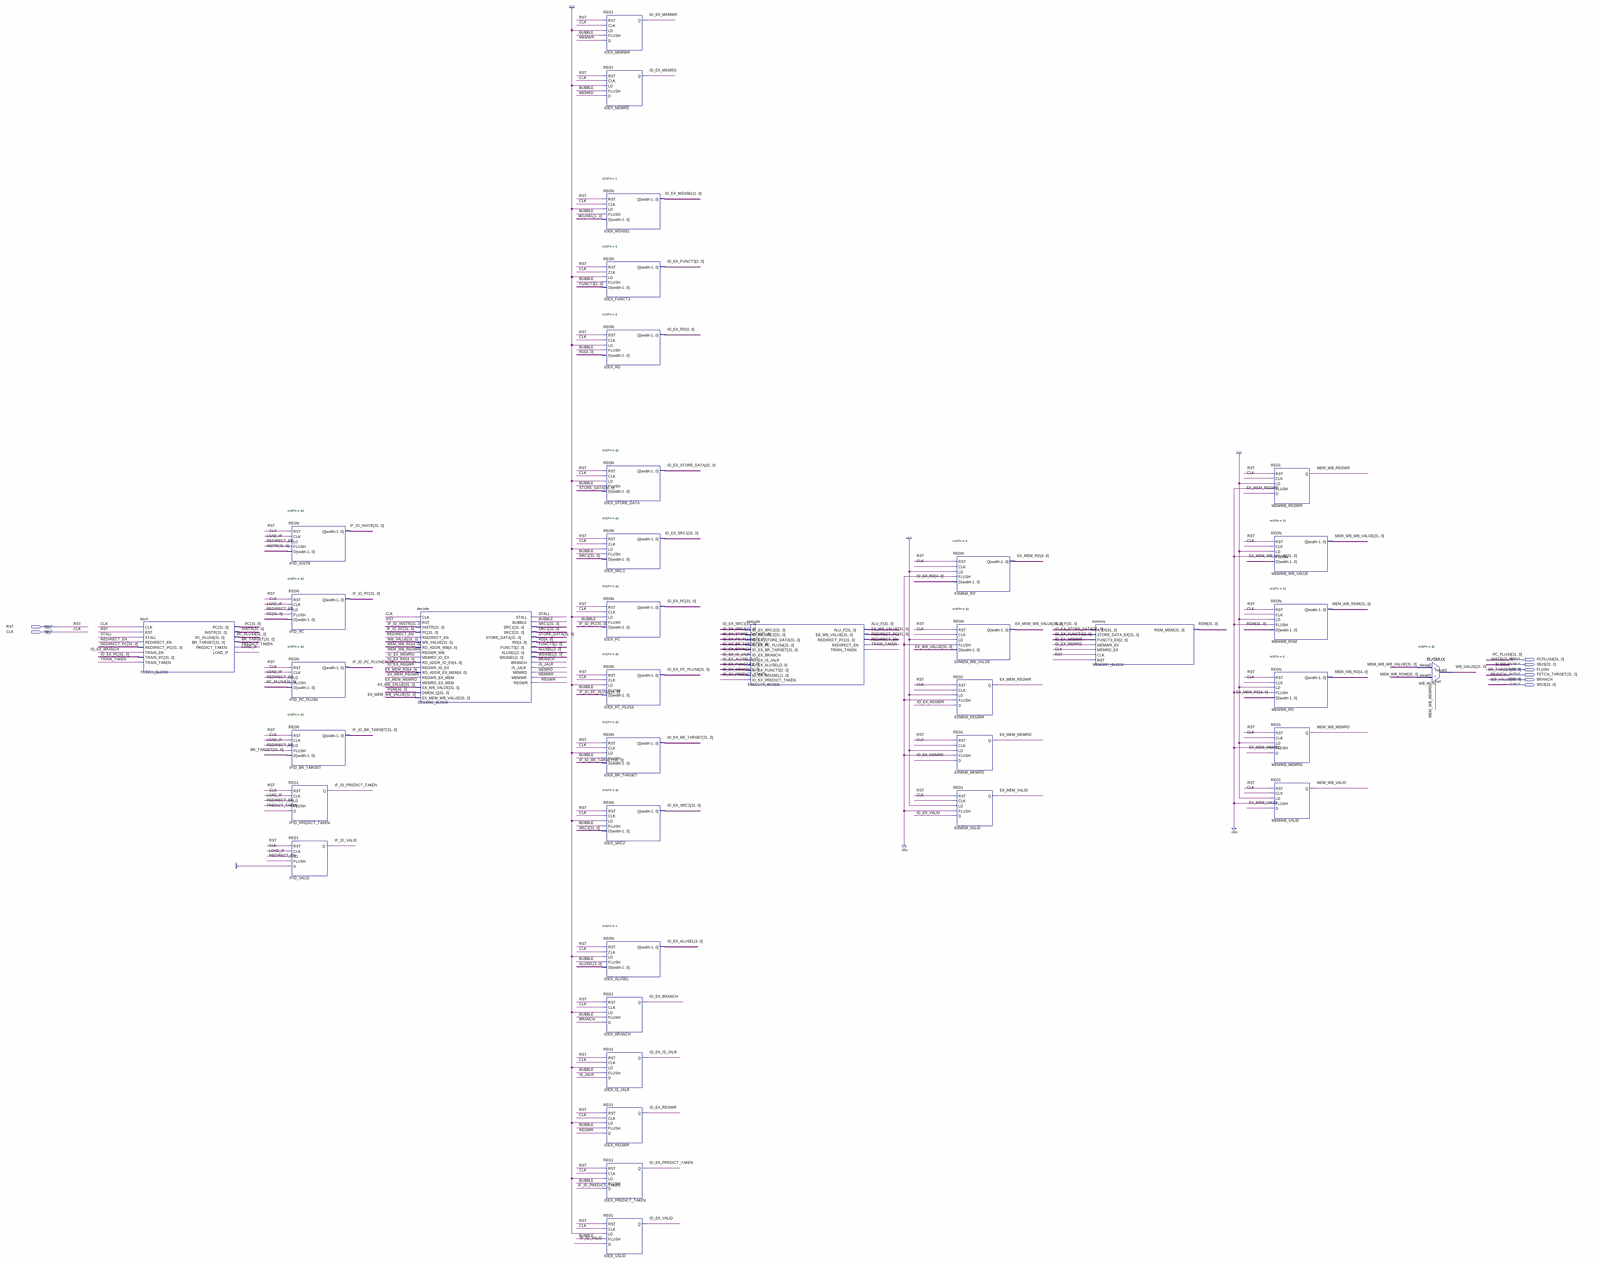
[diagram p0: schematic sheet, whole]
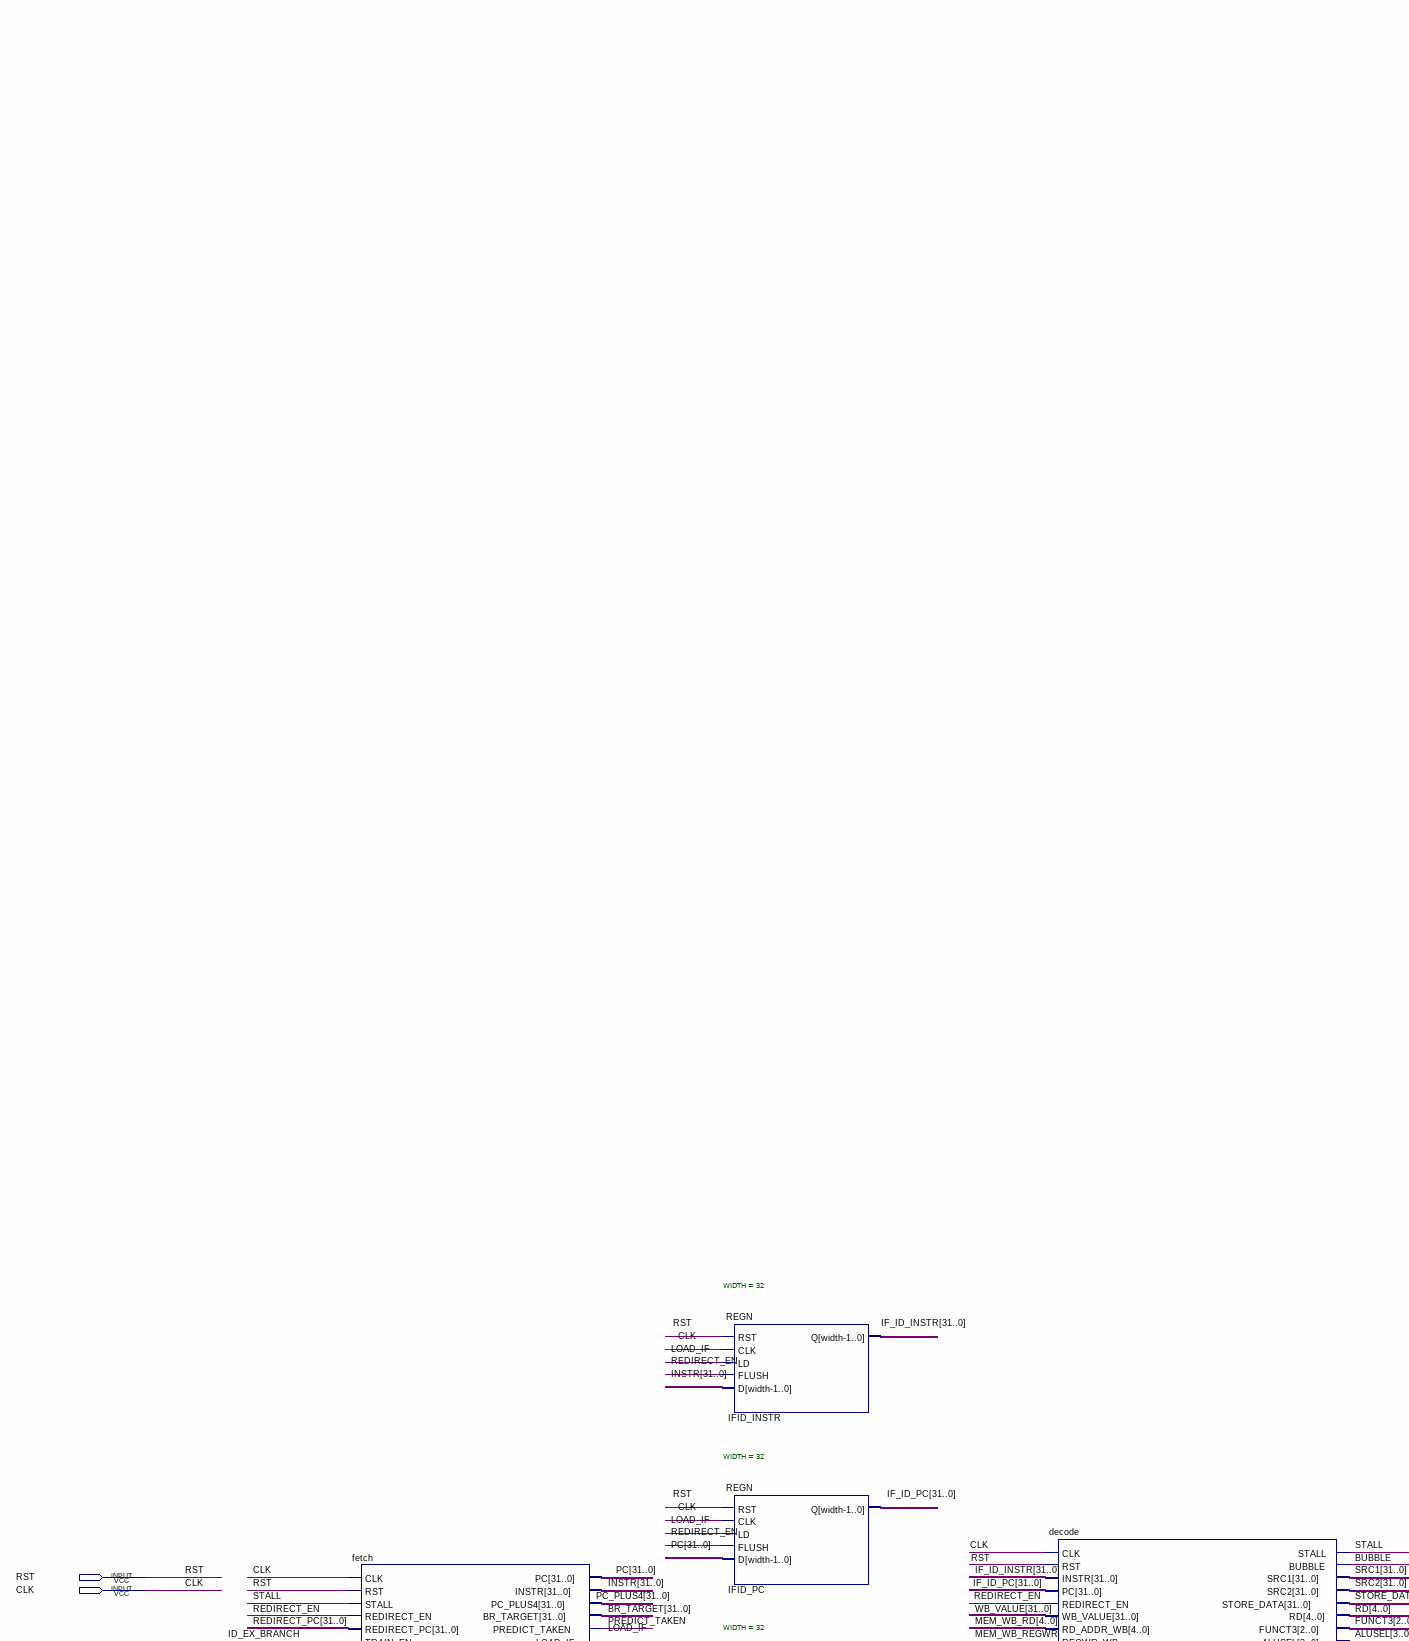
[diagram p1: schematic sheet, upper left part]
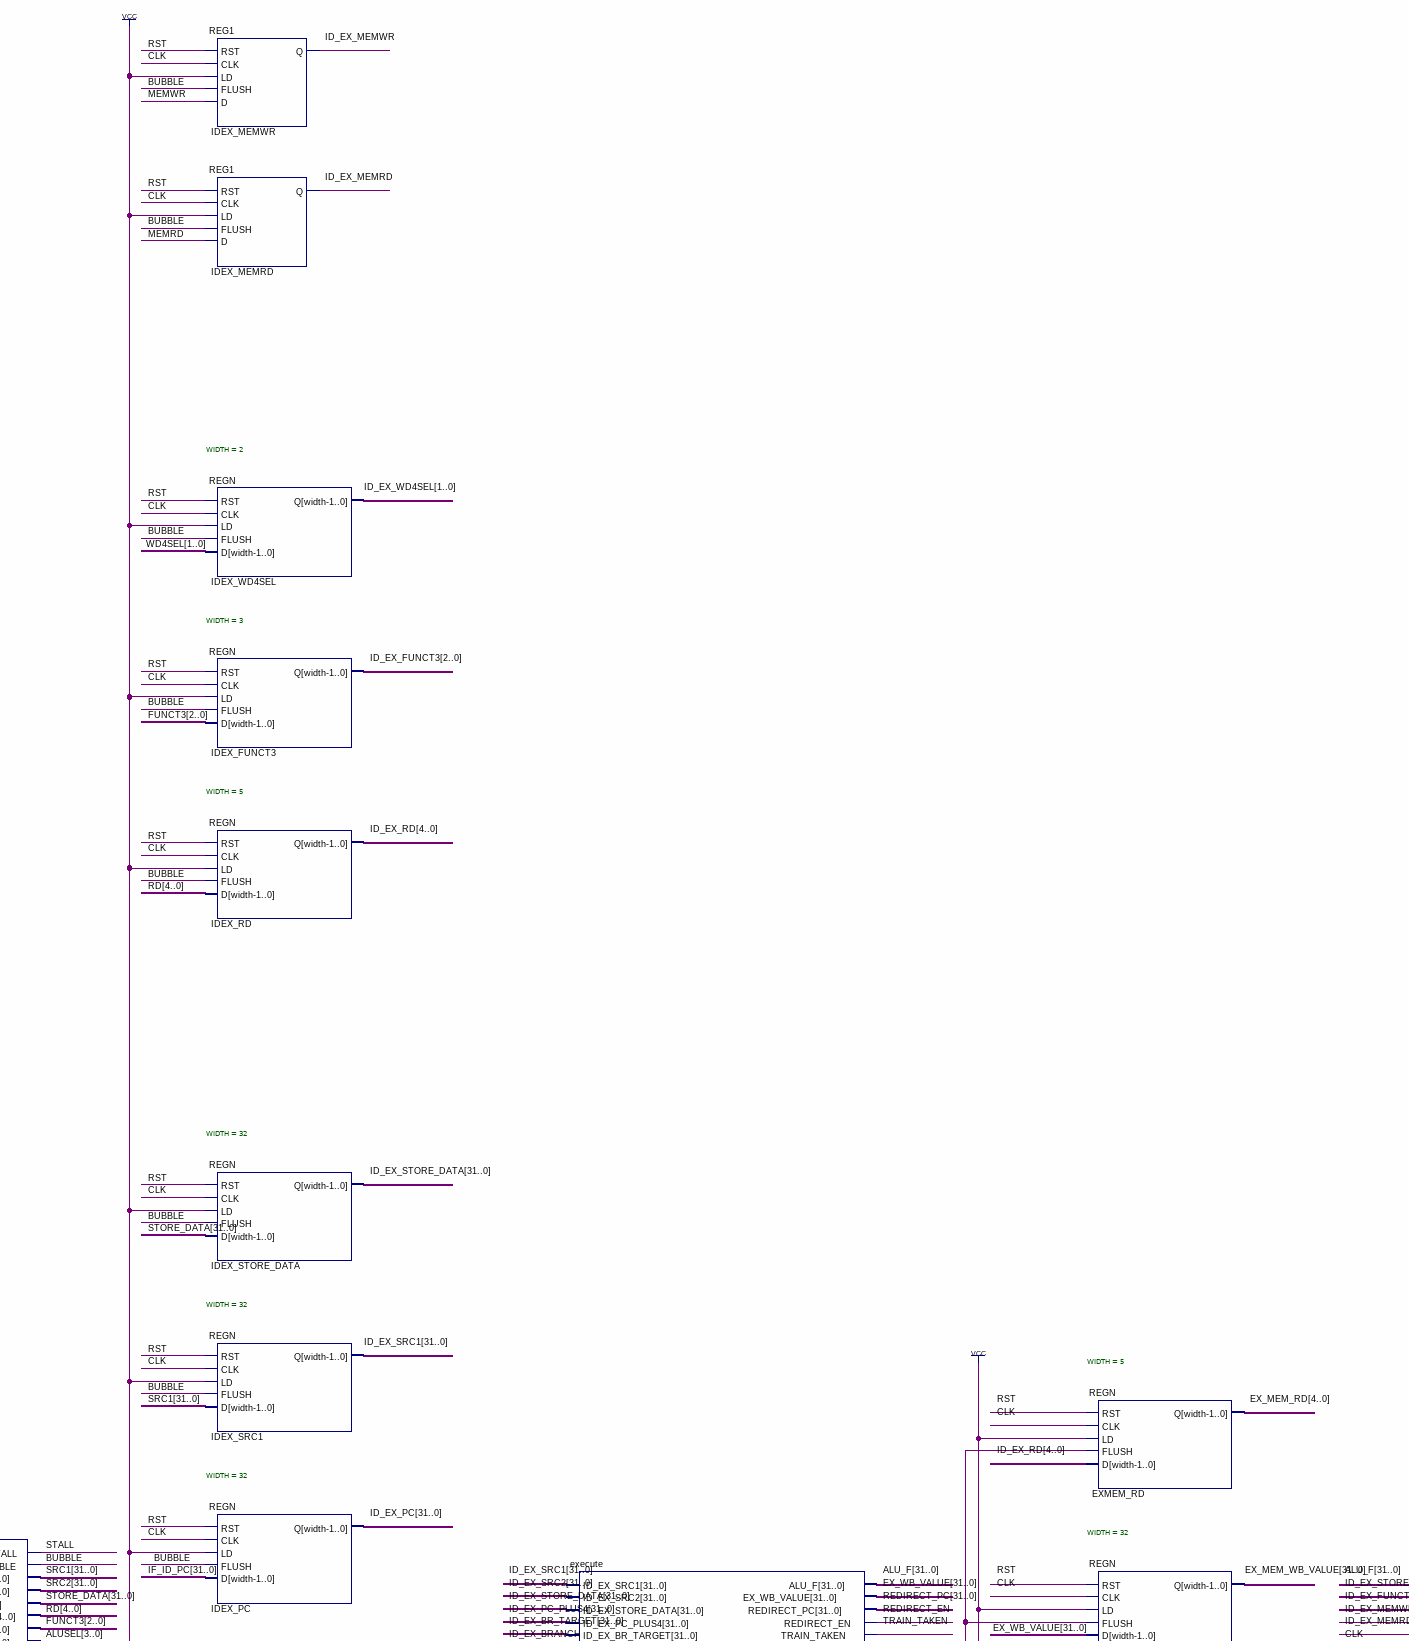
[diagram p2: schematic sheet, upper centre part]
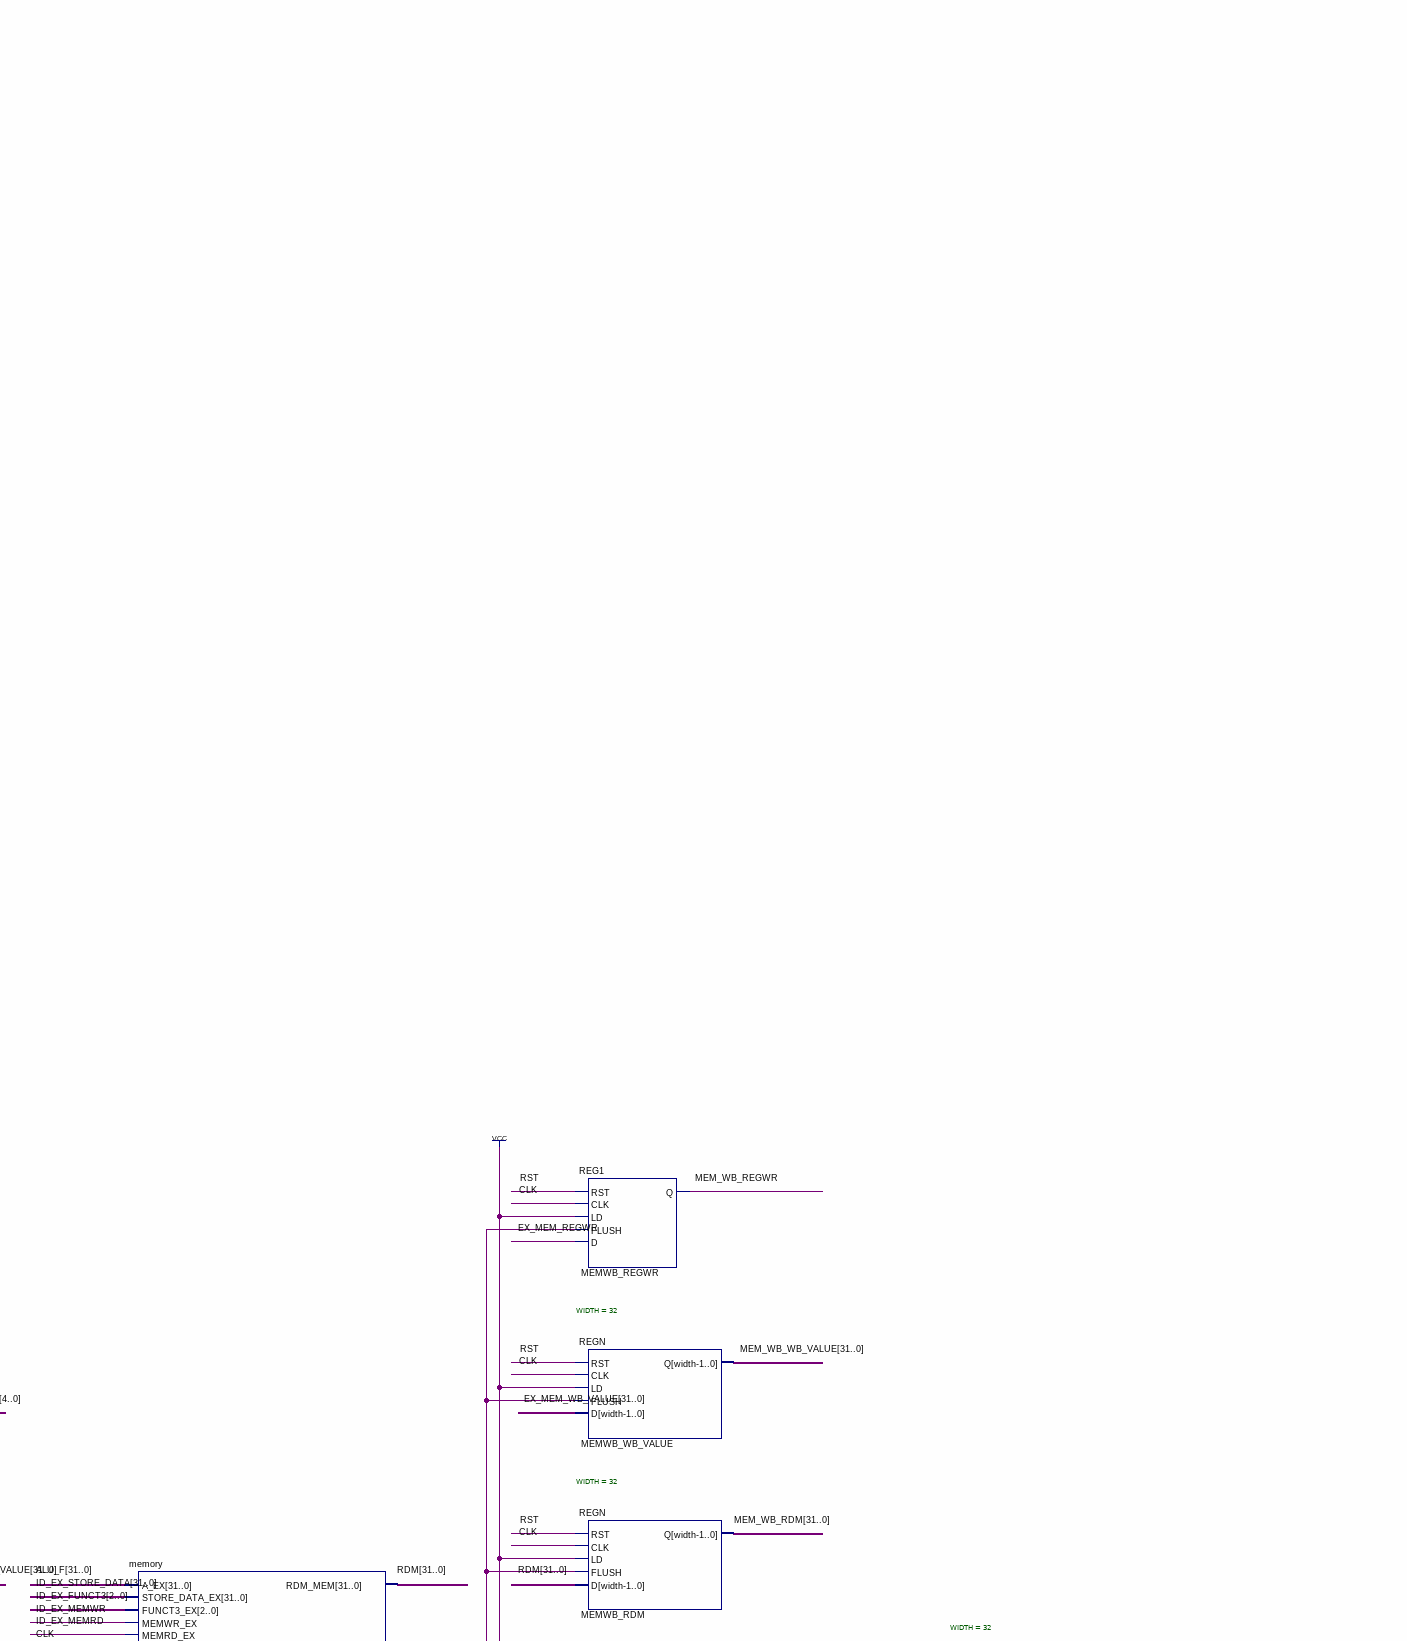
[diagram p3: schematic sheet, upper right part]
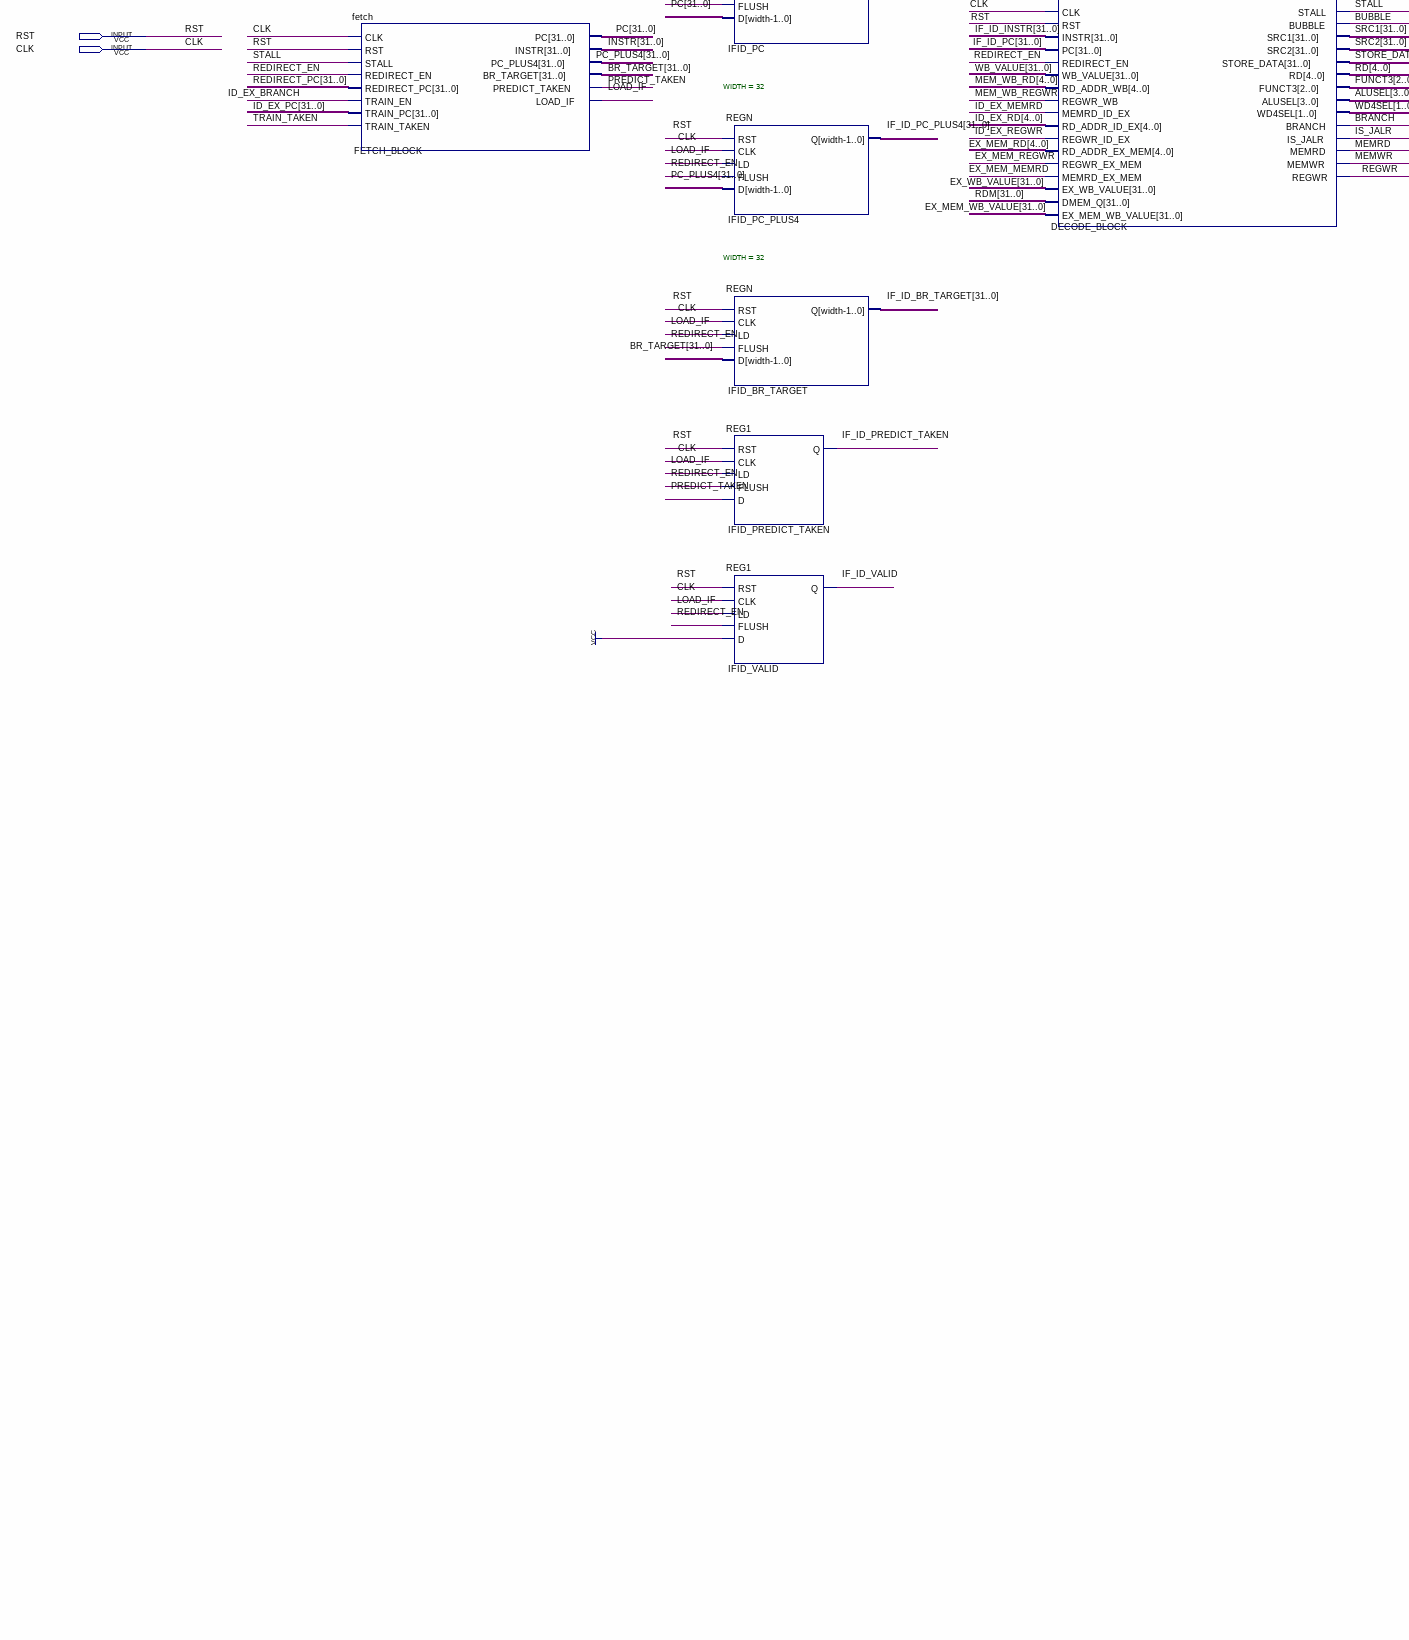
[diagram p4: schematic sheet, lower left part]
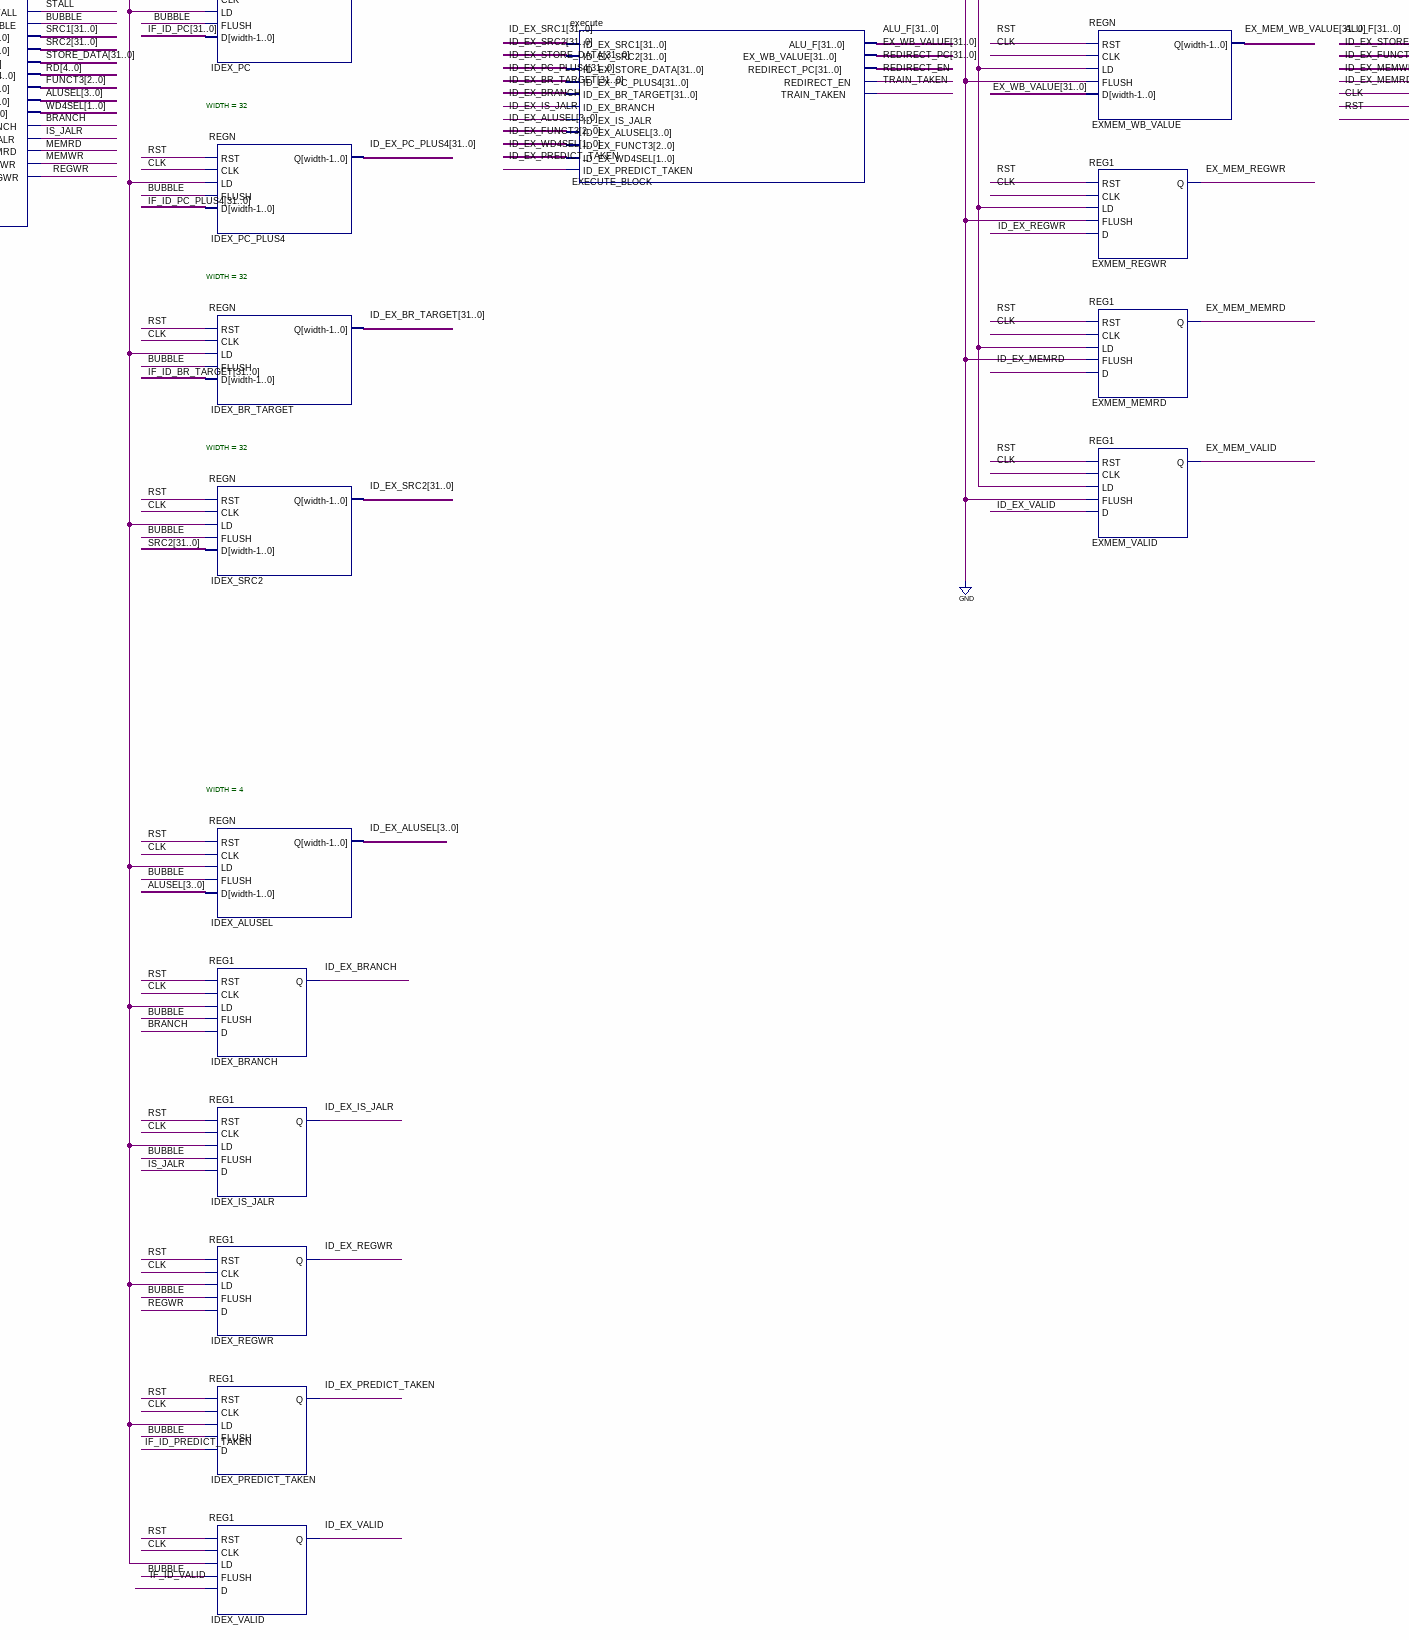
[diagram p5: schematic sheet, lower centre part]
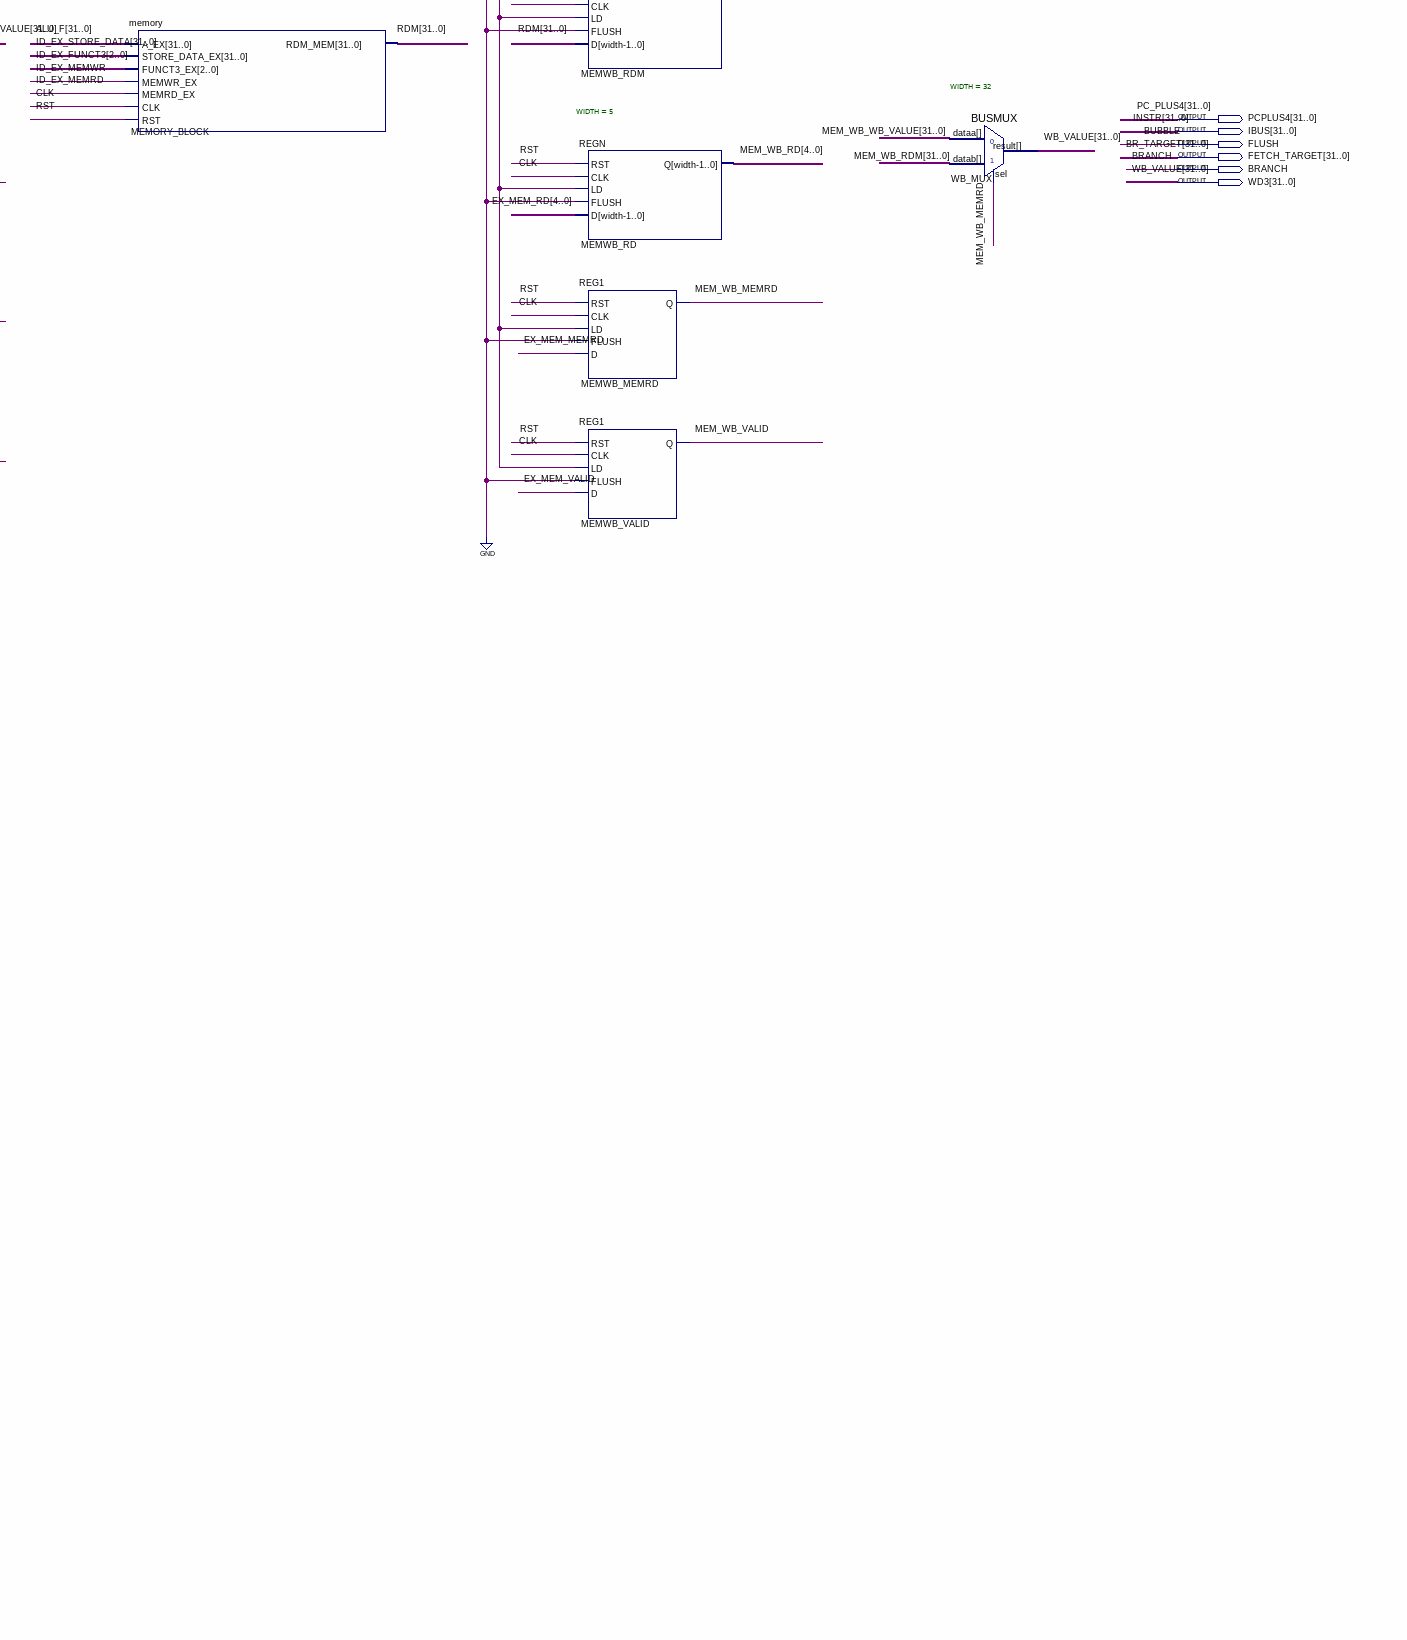
[diagram p6: schematic sheet, lower right part]
// Quartus schematic pipeline.bdf as structural Verilog: 39 symbols, 8 pins
module pipeline (
  input  RST,
  input  CLK,
  output [31:0] PCPLUS4,
  output [31:0] IBUS,
  output FLUSH,
  output [31:0] FETCH_TARGET,
  output BRANCH,
  output [31:0] WD3
);

  wire EX_MEM_MEMRD, EX_MEM_REGWR, EX_MEM_VALID, ID_EX_BRANCH, ID_EX_IS_JALR, ID_EX_MEMRD, ID_EX_MEMWR,
       ID_EX_PREDICT_TAKEN, ID_EX_REGWR, ID_EX_VALID, IF_ID_PREDICT_TAKEN, IF_ID_VALID, IS_JALR, LOAD_IF,
       MEM_WB_MEMRD, MEM_WB_REGWR, MEM_WB_VALID, MEMRD, MEMWR, PREDICT_TAKEN, REDIRECT_EN, REGWR, STALL,
       TRAIN_TAKEN;
  wire [1:0] ID_EX_WD4SEL, WD4SEL;
  wire [2:0] FUNCT3, ID_EX_FUNCT3;
  wire [3:0] ALUSEL, ID_EX_ALUSEL;
  wire [4:0] EX_MEM_RD, ID_EX_RD, MEM_WB_RD, RD;
  wire [31:0] ALU_F, EX_MEM_WB_VALUE, EX_WB_VALUE, ID_EX_BR_TARGET, ID_EX_PC, ID_EX_PC_PLUS4, ID_EX_SRC1,
       ID_EX_SRC2, ID_EX_STORE_DATA, IF_ID_BR_TARGET, IF_ID_INSTR, IF_ID_PC, IF_ID_PC_PLUS4, MEM_WB_RDM,
       MEM_WB_WB_VALUE, PC, RDM, REDIRECT_PC, SRC1, SRC2, STORE_DATA;

  fetch FETCH_BLOCK (
    .CLK(CLK), .RST(RST), .STALL(STALL), .REDIRECT_EN(REDIRECT_EN), .REDIRECT_PC(REDIRECT_PC),
    .TRAIN_EN(ID_EX_BRANCH), .TRAIN_PC(ID_EX_PC), .TRAIN_TAKEN(TRAIN_TAKEN), .PC(PC), .INSTR(IBUS),
    .PC_PLUS4(PCPLUS4), .BR_TARGET(FETCH_TARGET), .PREDICT_TAKEN(PREDICT_TAKEN), .LOAD_IF(LOAD_IF));
  REGN #(.WIDTH(32)) IFID_INSTR (.RST(RST), .CLK(CLK), .LD(LOAD_IF), .FLUSH(REDIRECT_EN), .D(IBUS), .Q(IF_ID_INSTR));
  REGN #(.WIDTH(32)) IFID_PC (.RST(RST), .CLK(CLK), .LD(LOAD_IF), .FLUSH(REDIRECT_EN), .D(PC), .Q(IF_ID_PC));
  REGN #(.WIDTH(32)) IFID_PC_PLUS4 (
    .RST(RST), .CLK(CLK), .LD(LOAD_IF), .FLUSH(REDIRECT_EN), .D(PCPLUS4), .Q(IF_ID_PC_PLUS4));
  REGN #(.WIDTH(32)) IFID_BR_TARGET (
    .RST(RST), .CLK(CLK), .LD(LOAD_IF), .FLUSH(REDIRECT_EN), .D(FETCH_TARGET), .Q(IF_ID_BR_TARGET));
  REG1 IFID_PREDICT_TAKEN (
    .RST(RST), .CLK(CLK), .LD(LOAD_IF), .FLUSH(REDIRECT_EN), .D(PREDICT_TAKEN), .Q(IF_ID_PREDICT_TAKEN));
  REG1 IFID_VALID (.RST(RST), .CLK(CLK), .LD(LOAD_IF), .FLUSH(REDIRECT_EN), .D(1'b1), .Q(IF_ID_VALID));
  decode DECODE_BLOCK (
    .CLK(CLK), .RST(RST), .INSTR(IF_ID_INSTR), .PC(IF_ID_PC), .REDIRECT_EN(REDIRECT_EN), .WB_VALUE(WD3),
    .RD_ADDR_WB(MEM_WB_RD), .REGWR_WB(MEM_WB_REGWR), .MEMRD_ID_EX(ID_EX_MEMRD), .RD_ADDR_ID_EX(ID_EX_RD),
    .REGWR_ID_EX(ID_EX_REGWR), .RD_ADDR_EX_MEM(EX_MEM_RD), .REGWR_EX_MEM(EX_MEM_REGWR),
    .MEMRD_EX_MEM(EX_MEM_MEMRD), .EX_WB_VALUE(EX_WB_VALUE), .DMEM_Q(RDM), .EX_MEM_WB_VALUE(EX_MEM_WB_VALUE),
    .STALL(STALL), .BUBBLE(FLUSH), .SRC1(SRC1), .SRC2(SRC2), .STORE_DATA(STORE_DATA), .RD(RD),
    .FUNCT3(FUNCT3), .ALUSEL(ALUSEL), .WD4SEL(WD4SEL), .BRANCH(BRANCH), .IS_JALR(IS_JALR), .MEMRD(MEMRD),
    .MEMWR(MEMWR), .REGWR(REGWR));
  REG1 IDEX_MEMWR (.RST(RST), .CLK(CLK), .LD(1'b1), .FLUSH(FLUSH), .D(MEMWR), .Q(ID_EX_MEMWR));
  REG1 IDEX_MEMRD (.RST(RST), .CLK(CLK), .LD(1'b1), .FLUSH(FLUSH), .D(MEMRD), .Q(ID_EX_MEMRD));
  REGN #(.WIDTH(2)) IDEX_WD4SEL (.RST(RST), .CLK(CLK), .LD(1'b1), .FLUSH(FLUSH), .D(WD4SEL), .Q(ID_EX_WD4SEL));
  REGN #(.WIDTH(3)) IDEX_FUNCT3 (.RST(RST), .CLK(CLK), .LD(1'b1), .FLUSH(FLUSH), .D(FUNCT3), .Q(ID_EX_FUNCT3));
  REGN #(.WIDTH(5)) IDEX_RD (.RST(RST), .CLK(CLK), .LD(1'b1), .FLUSH(FLUSH), .D(RD), .Q(ID_EX_RD));
  REGN #(.WIDTH(32)) IDEX_STORE_DATA (
    .RST(RST), .CLK(CLK), .LD(1'b1), .FLUSH(FLUSH), .D(STORE_DATA), .Q(ID_EX_STORE_DATA));
  REGN #(.WIDTH(32)) IDEX_SRC1 (.RST(RST), .CLK(CLK), .LD(1'b1), .FLUSH(FLUSH), .D(SRC1), .Q(ID_EX_SRC1));
  REGN #(.WIDTH(32)) IDEX_PC (.RST(RST), .CLK(CLK), .LD(1'b1), .FLUSH(FLUSH), .D(IF_ID_PC), .Q(ID_EX_PC));
  REGN #(.WIDTH(32)) IDEX_PC_PLUS4 (
    .RST(RST), .CLK(CLK), .LD(1'b1), .FLUSH(FLUSH), .D(IF_ID_PC_PLUS4), .Q(ID_EX_PC_PLUS4));
  REGN #(.WIDTH(32)) IDEX_BR_TARGET (
    .RST(RST), .CLK(CLK), .LD(1'b1), .FLUSH(FLUSH), .D(IF_ID_BR_TARGET), .Q(ID_EX_BR_TARGET));
  REGN #(.WIDTH(32)) IDEX_SRC2 (.RST(RST), .CLK(CLK), .LD(1'b1), .FLUSH(FLUSH), .D(SRC2), .Q(ID_EX_SRC2));
  REGN #(.WIDTH(4)) IDEX_ALUSEL (.RST(RST), .CLK(CLK), .LD(1'b1), .FLUSH(FLUSH), .D(ALUSEL), .Q(ID_EX_ALUSEL));
  REG1 IDEX_BRANCH (.RST(RST), .CLK(CLK), .LD(1'b1), .FLUSH(FLUSH), .D(BRANCH), .Q(ID_EX_BRANCH));
  REG1 IDEX_IS_JALR (.RST(RST), .CLK(CLK), .LD(1'b1), .FLUSH(FLUSH), .D(IS_JALR), .Q(ID_EX_IS_JALR));
  REG1 IDEX_REGWR (.RST(RST), .CLK(CLK), .LD(1'b1), .FLUSH(FLUSH), .D(REGWR), .Q(ID_EX_REGWR));
  REG1 IDEX_PREDICT_TAKEN (
    .RST(RST), .CLK(CLK), .LD(1'b1), .FLUSH(FLUSH), .D(IF_ID_PREDICT_TAKEN), .Q(ID_EX_PREDICT_TAKEN));
  REG1 IDEX_VALID (.RST(RST), .CLK(CLK), .LD(1'b1), .FLUSH(FLUSH), .D(IF_ID_VALID), .Q(ID_EX_VALID));
  execute EXECUTE_BLOCK (
    .ID_EX_SRC1(ID_EX_SRC1), .ID_EX_SRC2(ID_EX_SRC2), .ID_EX_STORE_DATA(ID_EX_STORE_DATA),
    .ID_EX_PC_PLUS4(ID_EX_PC_PLUS4), .ID_EX_BR_TARGET(ID_EX_BR_TARGET), .ID_EX_BRANCH(ID_EX_BRANCH),
    .ID_EX_IS_JALR(ID_EX_IS_JALR), .ID_EX_ALUSEL(ID_EX_ALUSEL), .ID_EX_FUNCT3(ID_EX_FUNCT3),
    .ID_EX_WD4SEL(ID_EX_WD4SEL), .ID_EX_PREDICT_TAKEN(ID_EX_PREDICT_TAKEN), .ALU_F(ALU_F),
    .EX_WB_VALUE(EX_WB_VALUE), .REDIRECT_PC(REDIRECT_PC), .REDIRECT_EN(REDIRECT_EN), .TRAIN_TAKEN(TRAIN_TAKEN));
  REGN #(.WIDTH(5)) EXMEM_RD (.RST(RST), .CLK(CLK), .LD(1'b1), .FLUSH(1'b0), .D(ID_EX_RD), .Q(EX_MEM_RD));
  REGN #(.WIDTH(32)) EXMEM_WB_VALUE (
    .RST(RST), .CLK(CLK), .LD(1'b1), .FLUSH(1'b0), .D(EX_WB_VALUE), .Q(EX_MEM_WB_VALUE));
  REG1 EXMEM_REGWR (.RST(RST), .CLK(CLK), .LD(1'b1), .FLUSH(1'b0), .D(ID_EX_REGWR), .Q(EX_MEM_REGWR));
  REG1 EXMEM_MEMRD (.RST(RST), .CLK(CLK), .LD(1'b1), .FLUSH(1'b0), .D(ID_EX_MEMRD), .Q(EX_MEM_MEMRD));
  REG1 EXMEM_VALID (.RST(RST), .CLK(CLK), .LD(1'b1), .FLUSH(1'b0), .D(ID_EX_VALID), .Q(EX_MEM_VALID));
  memory MEMORY_BLOCK (
    .A_EX(ALU_F), .STORE_DATA_EX(ID_EX_STORE_DATA), .FUNCT3_EX(ID_EX_FUNCT3), .MEMWR_EX(ID_EX_MEMWR),
    .MEMRD_EX(ID_EX_MEMRD), .CLK(CLK), .RST(RST), .RDM_MEM(RDM));
  REG1 MEMWB_REGWR (.RST(RST), .CLK(CLK), .LD(1'b1), .FLUSH(1'b0), .D(EX_MEM_REGWR), .Q(MEM_WB_REGWR));
  REGN #(.WIDTH(32)) MEMWB_WB_VALUE (
    .RST(RST), .CLK(CLK), .LD(1'b1), .FLUSH(1'b0), .D(EX_MEM_WB_VALUE), .Q(MEM_WB_WB_VALUE));
  REGN #(.WIDTH(32)) MEMWB_RDM (.RST(RST), .CLK(CLK), .LD(1'b1), .FLUSH(1'b0), .D(RDM), .Q(MEM_WB_RDM));
  REGN #(.WIDTH(5)) MEMWB_RD (.RST(RST), .CLK(CLK), .LD(1'b1), .FLUSH(1'b0), .D(EX_MEM_RD), .Q(MEM_WB_RD));
  REG1 MEMWB_MEMRD (.RST(RST), .CLK(CLK), .LD(1'b1), .FLUSH(1'b0), .D(EX_MEM_MEMRD), .Q(MEM_WB_MEMRD));
  REG1 MEMWB_VALID (.RST(RST), .CLK(CLK), .LD(1'b1), .FLUSH(1'b0), .D(EX_MEM_VALID), .Q(MEM_WB_VALID));
  BUSMUX #(.WIDTH(32)) WB_MUX (.datab(MEM_WB_RDM), .sel(MEM_WB_MEMRD), .dataa(MEM_WB_WB_VALUE), .result(WD3));

  // Other names for the same wires on the sheet: BR_TARGET[31:0] = FETCH_TARGET; BUBBLE = FLUSH; INSTR[31:0] = IBUS;
  //   PC_PLUS4[31:0] = PCPLUS4; WB_VALUE[31:0] = WD3
endmodule
